# EasyEDA schematic SCH_automated_chess_2024-11-14.json
TITLE: Hall matrix; REV: 1.0; Date: 2024-11-14; Sheet: 1/1; Drawn By: xavier.aiguaviva; Company: pipobimbo
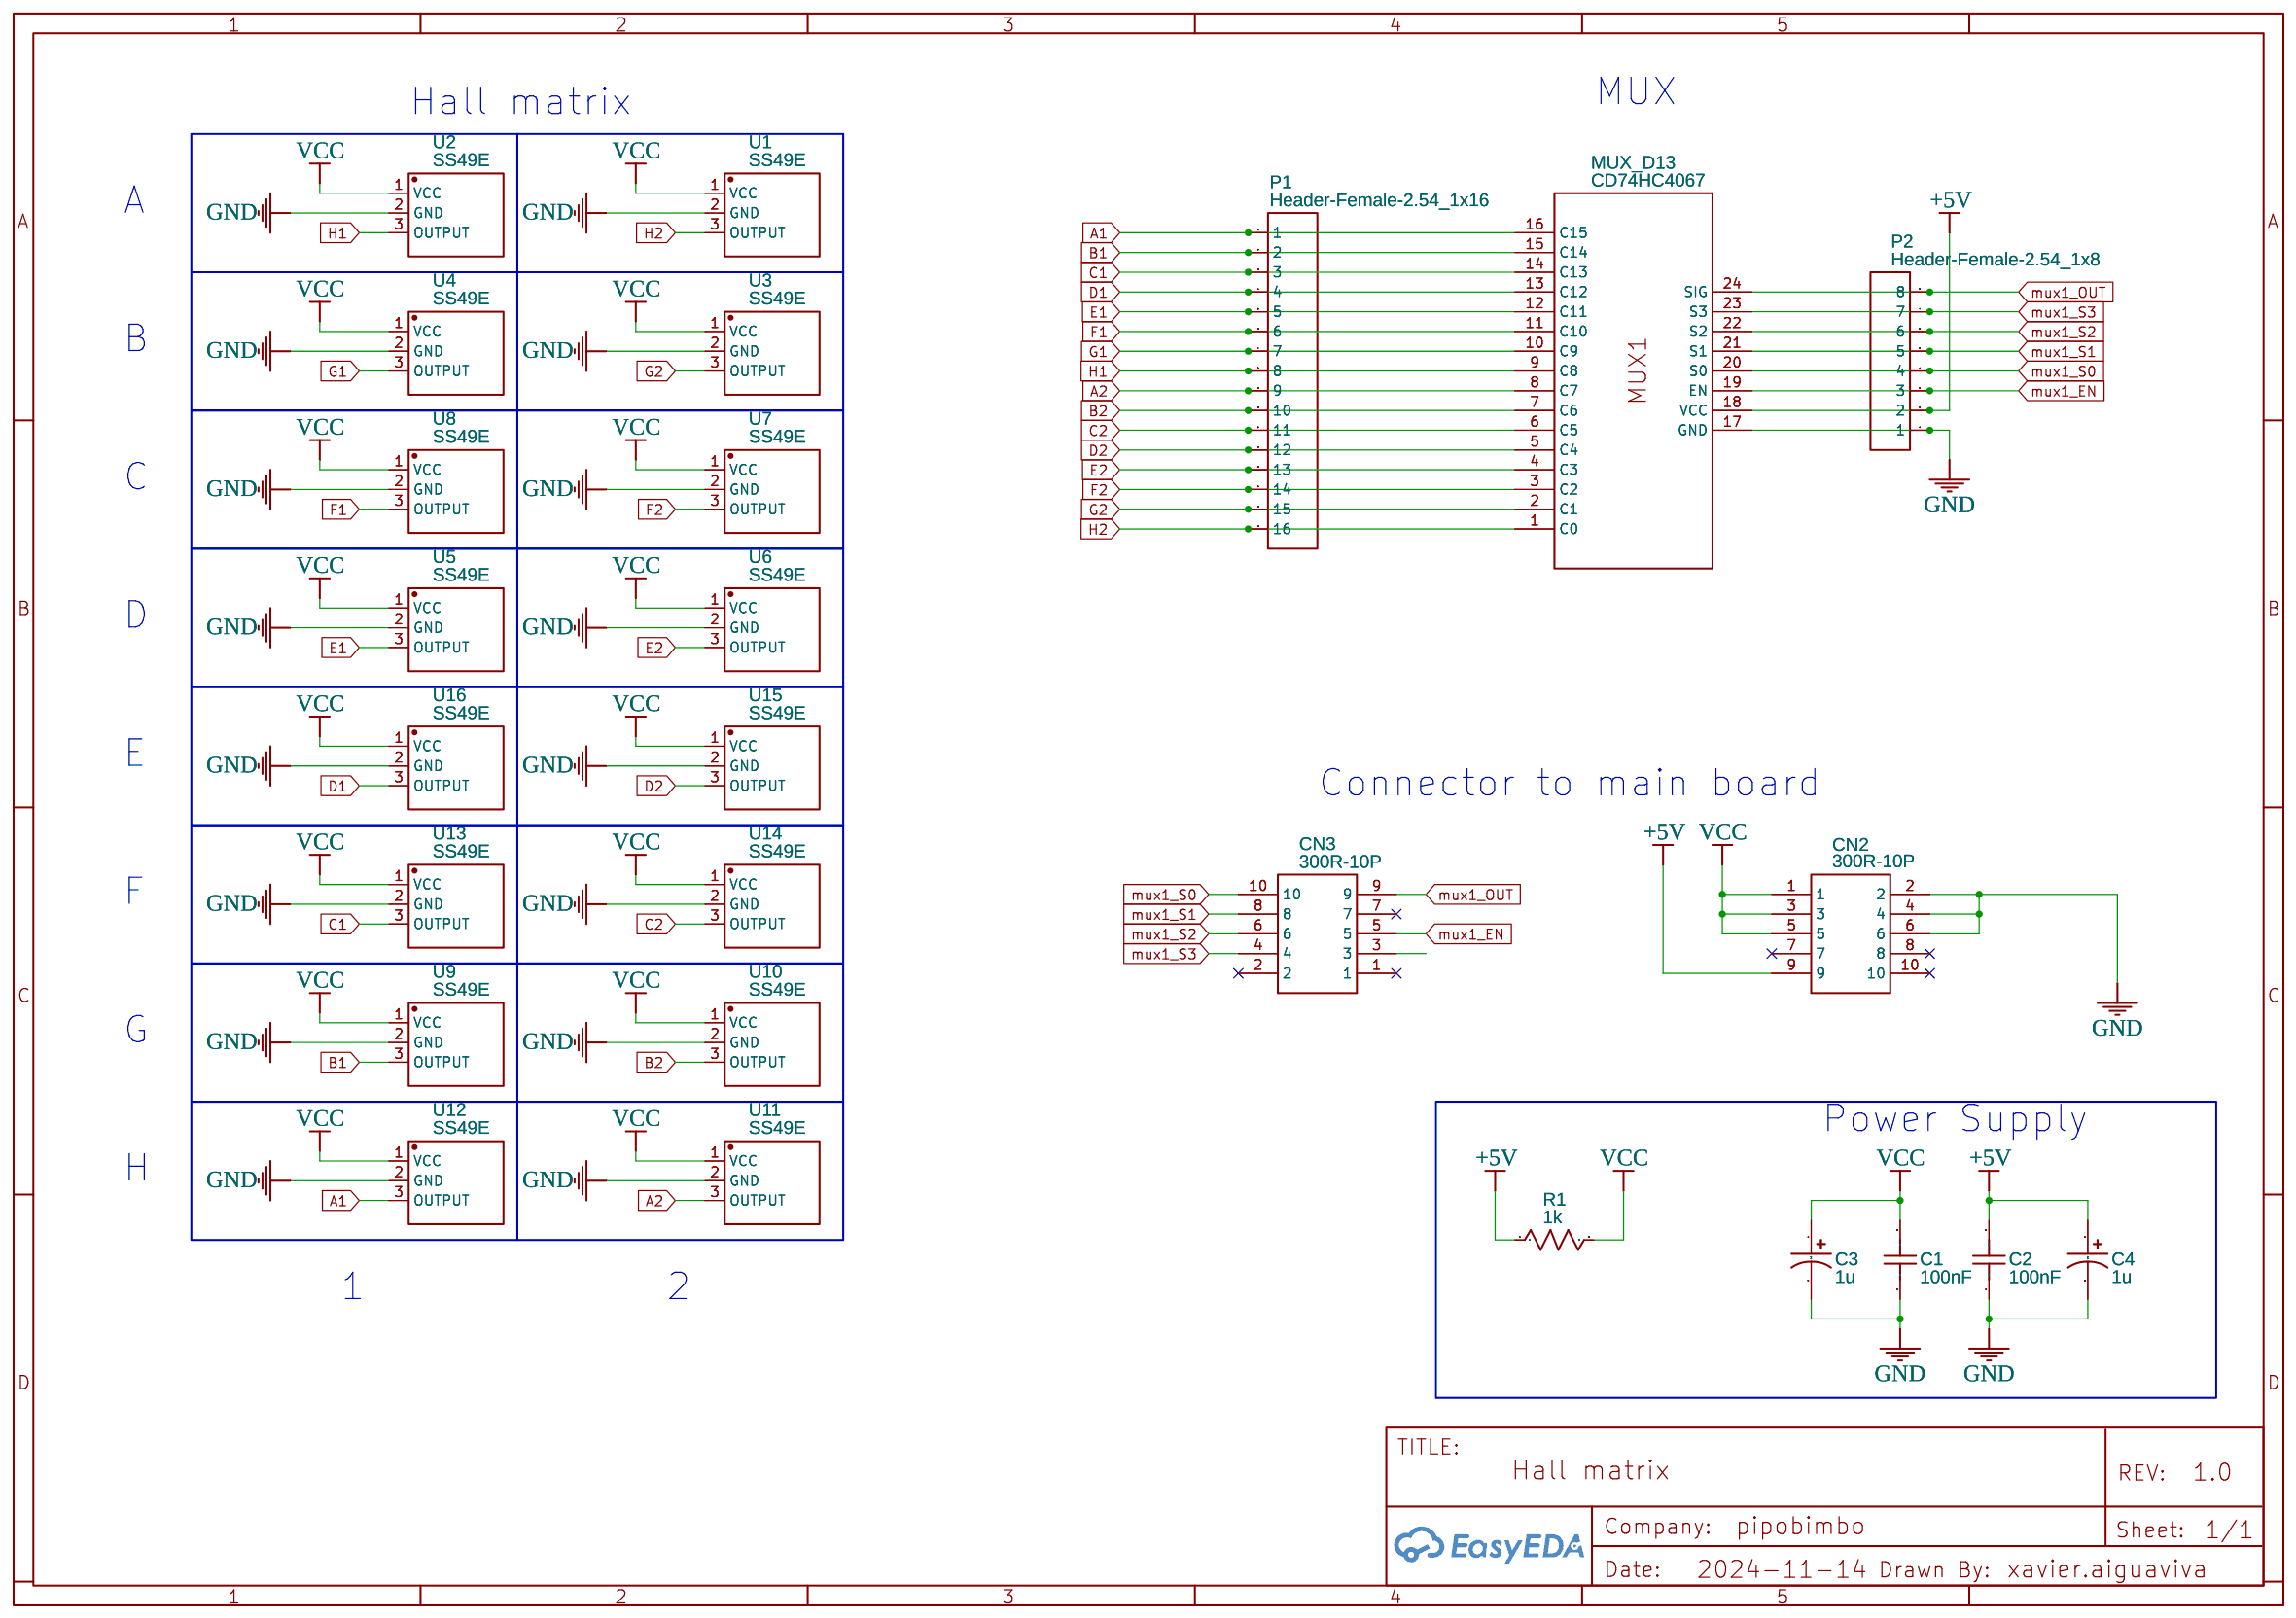
[diagram p0: schematic sheet]

## Parts
C1  100nF  [CAP-TH_L5.0-W2.5-P5.00-D1.0]
C2  100nF  [CAP-TH_L5.0-W2.5-P5.00-D1.0]
C3  1u  [CASE-D_7343]
C4  1u  [CASE-D_7343]
CN2  300R-10P  [IDC-TH_300R-10P]
CN3  300R-10P  [IDC-TH_300R-10P]
MUX_D13  CD74HC4067  [CD74HC4067]
P1  Header-Female-2.54_1x16  [HDR-TH_16P-P2.54-V-F-1]
P2  Header-Female-2.54_1x8  [HDR-TH_8P-P2.54-V-F-1]
R1  1k  [R1210]
U1  SS49E  [TO-92S_3P-L4.1-W1.6-P1.27-L]
U2  SS49E  [TO-92S_3P-L4.1-W1.6-P1.27-L]
U3  SS49E  [TO-92S_3P-L4.1-W1.6-P1.27-L]
U4  SS49E  [TO-92S_3P-L4.1-W1.6-P1.27-L]
U5  SS49E  [TO-92S_3P-L4.1-W1.6-P1.27-L]
U6  SS49E  [TO-92S_3P-L4.1-W1.6-P1.27-L]
U7  SS49E  [TO-92S_3P-L4.1-W1.6-P1.27-L]
U8  SS49E  [TO-92S_3P-L4.1-W1.6-P1.27-L]
U9  SS49E  [TO-92S_3P-L4.1-W1.6-P1.27-L]
U10  SS49E  [TO-92S_3P-L4.1-W1.6-P1.27-L]
U11  SS49E  [TO-92S_3P-L4.1-W1.6-P1.27-L]
U12  SS49E  [TO-92S_3P-L4.1-W1.6-P1.27-L]
U13  SS49E  [TO-92S_3P-L4.1-W1.6-P1.27-L]
U14  SS49E  [TO-92S_3P-L4.1-W1.6-P1.27-L]
U15  SS49E  [TO-92S_3P-L4.1-W1.6-P1.27-L]
U16  SS49E  [TO-92S_3P-L4.1-W1.6-P1.27-L]

## Library data of the parts
C1 C2 = CC1H104MC1FD3F6C10MF: Contributor: LCSC; Supplier: LCSC; Supplier Part: C254085; Manufacturer: Dersonic(德尔创); JLCPCB Part Class: Extended Part
C3 C4 = C_Tan_SMD_D_US: Contributor: LCEDA_Lib
CN2 = 300R-10P: Contributor: LCSC; Supplier: LCSC; Supplier Part: C132437; Manufacturer: Ckmtw(灿科盟); Manufacturer Part: B-3000R10P-0110; JLCPCB Part Class: Extended Part
CN3 = 300R-10P: Supplier: LCSC; Supplier Part: C132437; Manufacturer: Ckmtw(灿科盟); Manufacturer Part: B-3000R10P-0110; Contributor: LCSC; JLCPCB Part Class: Extended Part
MUX_D13 = CD74HC4067: sourceId: 1T5FDZYC8; Contributor: andy vu
P1 = Header-Female-2.54_1x16: Supplier: LCSC; Manufacturer: BOOMELE(博穆精密); Manufacturer Part: 2.54-1*16P母; Supplier Part: C66987; JLCPCB Part Class: Extended Part
P2 = Header-Female-2.54_1x8: Supplier: LCSC; Manufacturer: BOOMELE(博穆精密); Manufacturer Part: 2.54-1*8P母环保; Supplier Part: C27438; JLCPCB Part Class: Extended Part
R1 = R_1210_US: Contributor: LCEDA_Lib
U1-U16 = SS49E: Contributor: LCSC; Supplier: LCSC; Manufacturer: Honeywell(霍尼韦尔); Supplier Part: C85697; JLCPCB Part Class: Extended Part

## Nets
+5V: C2.2 C4.1 CN2.9 MUX_D13.18(VCC) P2.2 R1.1
GND: C1.1 C2.1 C3.2 C4.2 CN2.2 CN2.4 CN2.6 MUX_D13.17(GND) P2.1 U1.2(GND) U2.2(GND) U3.2(GND) U4.2(GND) U5.2(GND) U6.2(GND) U7.2(GND) U8.2(GND) U9.2(GND) U10.2(GND) U11.2(GND) U12.2(GND) U13.2(GND) U14.2(GND) U15.2(GND) U16.2(GND)
VCC: C1.2 C3.1 CN2.1 CN2.3 CN2.5 R1.2 U1.1(VCC) U2.1(VCC) U3.1(VCC) U4.1(VCC) U5.1(VCC) U6.1(VCC) U7.1(VCC) U8.1(VCC) U9.1(VCC) U10.1(VCC) U11.1(VCC) U12.1(VCC) U13.1(VCC) U14.1(VCC) U15.1(VCC) U16.1(VCC)
A1: MUX_D13.16(C15) P1.1 U12.3(OUTPUT)
A2: MUX_D13.8(C7) P1.9 U11.3(OUTPUT)
B1: MUX_D13.15(C14) P1.2 U9.3(OUTPUT)
B2: MUX_D13.7(C6) P1.10 U10.3(OUTPUT)
C1: MUX_D13.14(C13) P1.3 U13.3(OUTPUT)
C2: MUX_D13.6(C5) P1.11 U14.3(OUTPUT)
D1: MUX_D13.13(C12) P1.4 U16.3(OUTPUT)
D2: MUX_D13.5(C4) P1.12 U15.3(OUTPUT)
E1: MUX_D13.12(C11) P1.5 U5.3(OUTPUT)
E2: MUX_D13.4(C3) P1.13 U6.3(OUTPUT)
F1: MUX_D13.11(C10) P1.6 U8.3(OUTPUT)
F2: MUX_D13.3(C2) P1.14 U7.3(OUTPUT)
G1: MUX_D13.10(C9) P1.7 U4.3(OUTPUT)
G2: MUX_D13.2(C1) P1.15 U3.3(OUTPUT)
H1: MUX_D13.9(C8) P1.8 U2.3(OUTPUT)
H2: MUX_D13.1(C0) P1.16 U1.3(OUTPUT)
mux1_EN: CN3.5 MUX_D13.19(EN) P2.3
mux1_OUT: CN3.9 MUX_D13.24(SIG) P2.8
mux1_S0: CN3.10 MUX_D13.20(S0) P2.4
mux1_S1: CN3.8 MUX_D13.21(S1) P2.5
mux1_S2: CN3.6 MUX_D13.22(S2) P2.6
mux1_S3: CN3.4 MUX_D13.23(S3) P2.7

Not connected (* = marked no-connect by the designer): CN2 7* 8* 10*; CN3 1* 2* 3 7*

## Notes on the sheet
- Hall matrix
- MUX
- A
- B
- C
- D
- E
- Connector to main board
- F
- G
- Power Supply
- H
- 1
- 2
